# Altium schematic sheet power + display.SchDoc
size A4; SheetNumber: 2; SheetTotal: 2
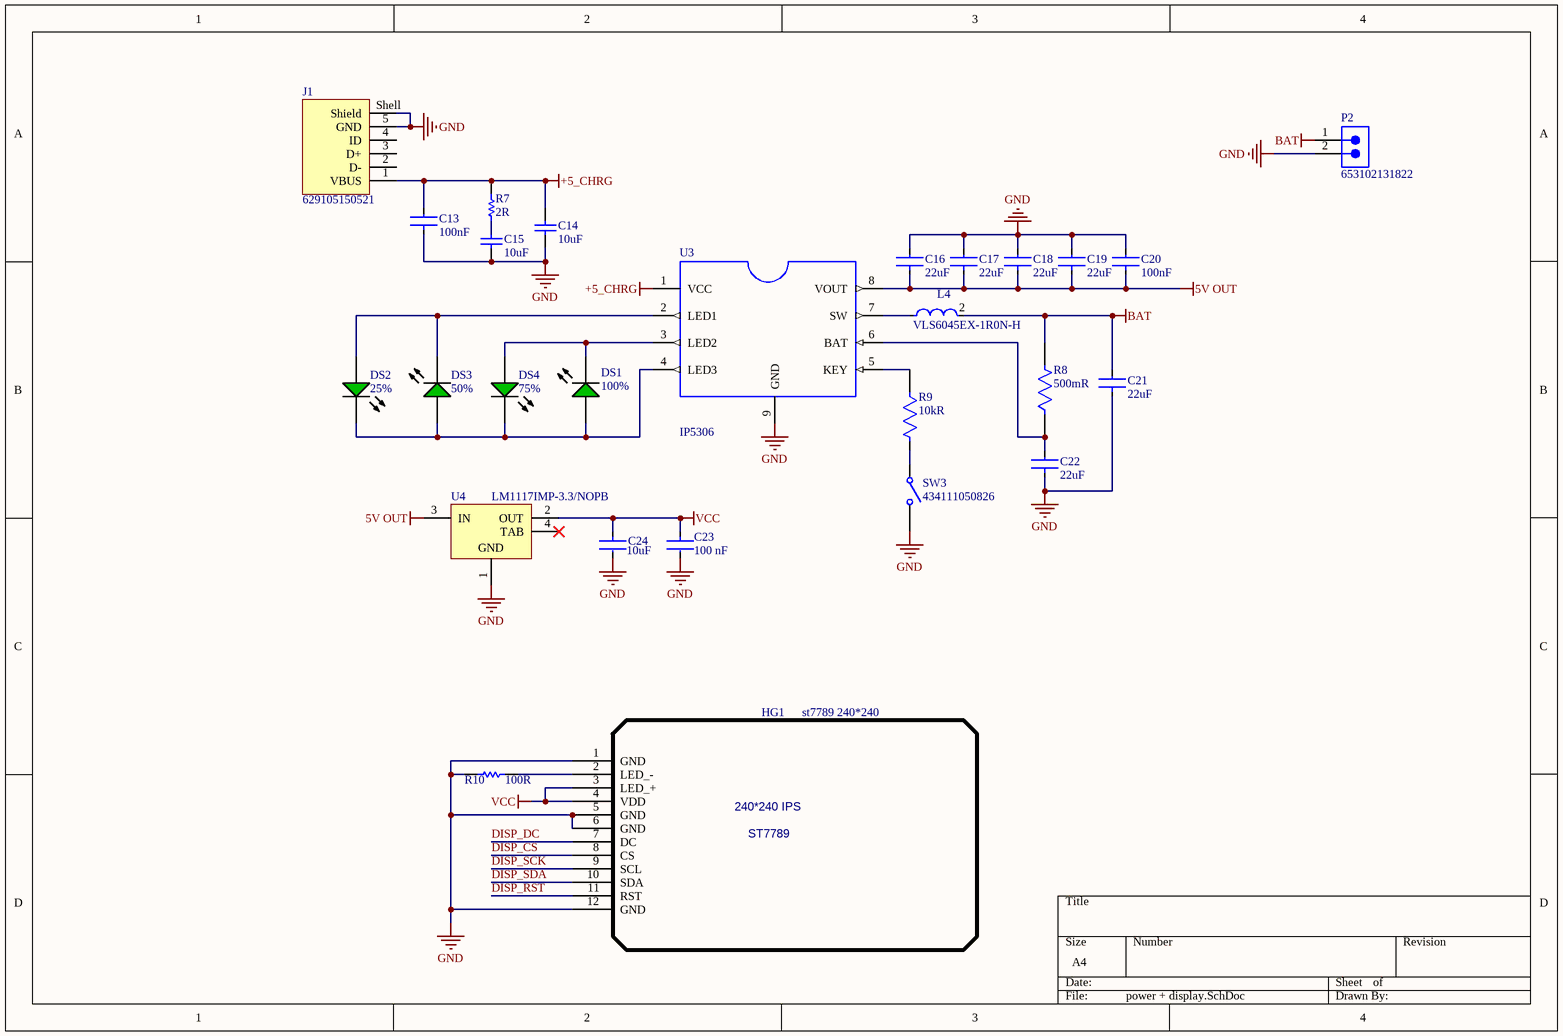
[diagram p0: power + display.SchDoc]

## Parts
C13  Capacitance: 100nF  [FP-CGA3E-0_3-0_1-IPC_A]  (hidden comment: CGA3E2X7R1H104K080AA)
C14  10uF  [CAPC2013X140X45NL15T25]
C15  10uF  [CAPC2013X140X45NL15T25]
C16  Capacitance: 22uF  [FP-1206-L_3_2_0_2-W_1_6_0-IPC_A]  (hidden comment: 12066C226KAT2A)
C17  Capacitance: 22uF  [FP-1206-L_3_2_0_2-W_1_6_0-IPC_A]  (hidden comment: 12066C226KAT2A)
C18  Capacitance: 22uF  [FP-1206-L_3_2_0_2-W_1_6_0-IPC_A]  (hidden comment: 12066C226KAT2A)
C19  Capacitance: 22uF  [FP-1206-L_3_2_0_2-W_1_6_0-IPC_A]  (hidden comment: 12066C226KAT2A)
C20  Capacitance: 100nF  [FP-CGA3E-0_3-0_1-IPC_A]  (hidden comment: CGA3E2X7R1H104K080AA)
C21  Capacitance: 22uF  [FP-1206-L_3_2_0_2-W_1_6_0-IPC_A]  (hidden comment: 12066C226KAT2A)
C22  Capacitance: 22uF  [FP-1206-L_3_2_0_2-W_1_6_0-IPC_A]  (hidden comment: 12066C226KAT2A)
C23  value 100 nF  [FP-CC0402-MFG]  (hidden comment: CC0402KRX7R9BB104)
C24  Capacitance: 10uF  [FP-C1608-080-0_1-MFG]  (hidden comment: C1608X5R1A106K080AC)
DS1  100%  [AVAG-HSMX-C170_V]
DS2  25%  [AVAG-HSMX-C170_V]
DS3  50%  [AVAG-HSMX-C170_V]
DS4  75%  [AVAG-HSMX-C170_V]
HG1  st7789 240*240  [PCBComponent_1]
J1  629105150521  [629105150521]
L4  VLS6045EX-1R0N-H  [FP-VLS6045EX-H-MFG]
P2  653102131822  [653102131822]
R7  2R  [RESC2013X60X30ML20T20]
R8  500mR  [FP-CSR0603-IPC_B]
R9  Resistance: 10kR  [FP-MCT0603-IPC_C]  (hidden comment: MCT06030C1002FP500)
R10  100R  [RESC1609X50X30LL10T20]
SW3  434111050826  [WS-TASV_L6W3.5H5_4341x10508x6]
U3  IP5306  [SOIC9P127_490X600X170L84X42T330X241N]
U4  LM1117IMP-3.3/NOPB  [DCY0004A_N]

## Nets
5V OUT: C16.1 C17.1 C18.1 C19.1 C20.1 U3.8(VOUT) U4.3(IN)
+5_CHRG: C13.2 C14.2 J1.1(VBUS) R7.2 U3.1(VCC)
BAT: C21.2 L4.2 P2.1 R8.2
GND: C13.1 C14.1 C15.1 C16.2 C17.2 C18.2 C19.2 C20.2 C21.1 C22.1 C23.2 C24.1 HG1.1(GND) HG1.5(GND) HG1.6(GND) HG1.12(GND) J1.5(GND) J1.Shell(Shield) P2.2 R10.1 SW3.2 U3.9(GND) U4.1(GND)
VCC: C23.1 C24.2 HG1.3(LED_+) HG1.4(VDD) U4.2(OUT)
DISP_CS: HG1.8(CS)
DISP_DC: HG1.7(DC)
DISP_RST: HG1.11(RST)
DISP_SCK: HG1.9(SCL)
DISP_SDA: HG1.10(SDA)
NetC15_2: C15.2 R7.1
NetC22_2: C22.2 R8.1 U3.6(BAT)
NetDS1_1: DS1.1(A) DS2.2(K) DS3.1(A) DS4.2(K) U3.4(LED3)
NetDS1_2: DS1.2(K) DS4.1(A) U3.3(LED2)
NetDS2_1: DS2.1(A) DS3.2(K) U3.2(LED1)
NetHG1_2: HG1.2(LED_-) R10.2
NetL4_1: L4.1 U3.7(SW)
NetR9_1: R9.1 U3.5(KEY)
NetR9_2: R9.2 SW3.1

Not connected (* = marked no-connect by the designer): J1 2(D-) 3(D+) 4(ID); U4 4(TAB)*

## Notes on the sheet
- (in symbol st7789 240*240) 240*240 IPS; ST7789

## Library data of the parts
C13 C20 = CMP-2000-07546-2: Cap Ceramic 100nF 50V X7R 10% Pad SMD 0603 +125°C Automotive T/R; Weight: 7.1E-05oz; Composition: Ceramic; Max Operating Temperature: 125°C; Termination: SMD/SMT; Dielectric: X7R; Length: 1.6mm; Package Quantity: 1; REACH SVHC: No SVHC; Lead Free: Lead Free; Case Code (Metric): 1608; Min Operating Temperature: -55°C; Packaging: Tape and Reel; Tolerance: 10%; Voltage Rating: 50V; Case Code (Imperial): 0603; Case/Package: 0603; Voltage Rating (DC): 50V; Depth: 0.8mm; Radiation Hardening: No; Ratings: AEC-Q200; Mount: Surface Mount; Voltage: 50V; Thickness: 0.035inch; Width: 0.8mm; Height: 0.8mm
C14 C15 = CMP-2007-03395-1: Part Number: GRM21BR71A106KE51L; Manufacturer: Murata
C16-C19 C21 C22 = CMP-1037-04985-3: CAP CER 22UF 6.3V X7R 1206; Tolerance: 10%; Dissipation Factor: 5%; Thickness: 0.07inch; Min Operating Temperature: -55°C; Width: 1.6mm; Case Code (Metric): 3216; Construction: Flat; Max Operating Temperature: 125°C; Case/Package: 1206; Case Code (Imperial): 1206; Lead Free: Lead Free; REACH SVHC: No SVHC; Voltage Rating (DC): 6.3V; Number of Pins: 2; Contact Plating: Tin; Dielectric: X7R; Radiation Hardening: No; Depth: 1.6mm; Series: FlEXITERM; Mount: Surface Mount; Voltage Rating: 6.3V; Package Quantity: 2500; RoHS Compliant: Yes; Length: 3.2mm; Height: 1.78mm; Voltage: 6.3V; Termination: SMD/SMT; Packaging: Tape and Reel
C23 = CMP-03422-001010-1: CAP CER 0.1UF 50V X7R 0402; Manufacturer: YAGEO; Temperature Coefficient: 30ppm/°C; Material: Ceramic; Automotive Grade: NA; Tolerance: 0.1; Footprint Url: http://www.yageo.com/exep/pages/download/literatures/UPY-C_GEN_24.pdf; Category: Cap; Capacitance: 100 nF; Package: CC0402; Voltage Rating: 50 V; ComponentLink2Description: Datasheet; Temperature Characteristic: X7R; Device Class L1: Passive Components; Device Class L2: Capacitors; Digikey Description: CAP CER 0.1UF 50V X7R 0402; Octopart: https://octopart.com/cc0402krx7r9bb104-yageo-56536067; Device Class L3: Ceramic Capacitors; Height: 0.55mm; Temperature: -55°C to +125°C; Temperature Range High: +125°C; ComponentLink2URL: http://www.yageo.com/documents/recent/UPY-GP_NP0_16V-to-50V_16.pdf; Temperature Range Low: -55°C; RoHS: TRUE; Ipc Land Pattern Name: CAPC10050X50; Lead Free: Yes; Automotive: No; Manufacturer Part Number: CC0402KRX7R9BB104
C24 = CMP-2000-04979-3: Multilayer Ceramic Capacitors 10μF ±10% 10V X5R SMD 0603; Dielectric Material: Ceramic; Construction: Flat; Height: 0.8mm; Thickness: 0.035inch; Case Code (Metric): 1608; Radiation Hardening: No; Number of Pins: 2; Voltage Rating (DC): 10V; Depth: 0.8mm; Voltage: 10V; RoHS Compliant: Yes; Voltage Rating: 10V; Package Quantity: 1; Resistor Type: Ceramic; Termination: SMD/SMT; Lead Free: Lead Free; REACH SVHC: No SVHC; Tolerance: 10%; Mount: Surface Mount; Series: C; Packaging: Tape and Reel; Width: 0.8mm; Dielectric: X5R; Weight: 7.1E-05oz; Length: 1.6mm; Max Operating Temperature: 85°C; Case Code (Imperial): 0603; Case/Package: 0603; Min Operating Temperature: -55°C
DS1-DS4 = CMP-2000-05062-1: Chip LED, Green, 2.2 V, -40 to 85 degC, 2-Pin SMD, Pb-Free, Tape and Reel; Manufacturer: Avago; No. of Pins: 2; Peak Wavelength: 570nm; SVHC: NoSVHC(16-Jun-2014); Dominant Wavelength: 572nm; Forward Current If: 20mA; Viewing Angle: 170deg; Lens Shape: Rectangular; PIV Max: 5V; External Width: 1.25mm; LED Type: Standard; External Depth: 0.8mm; Opto Mounting Orientation: Top; Luminous Intensity: 15mcd; Luminous Intensity Min: 4mcd; Forward Voltage VF Max: 2.6V; External Length / Height: 2mm; Bulb Size: 1.25mmx1.4mm; Light Area Height: 1mm; Voltage Vf Typ: 2.2V; Operating Temperature Max: 85degC; Datasheet Version: Oct-08; MSL: MSL2A-4weeks; Peak Forward Current: 20mA; Package Description: 2-Pin Surface Mount Device, Body 2 x 1.25 mm, Height 0.8 mm; Datasheet URL: https://datasheet.ciiva.com/29280/180495-da-01-en-chip-led-hsmg-c170-gelb-gruen-29280971.pdf; Storage Temperature Min: -40degC; LED Colour: Green; Wavelength Typ: 570nm; Mounting Type: SMD; Forward Current If Max: 20mA; Dominant Wavelength Typ: 572nm; LED Mounting: SMD; Operating Temperature Range: -30degCto+85degC; Operating Temperature Min: -30degC; Manufacturer URL: http://www.avagotech.com/; Packaging: CutTape; Luminous Intensity Typ: 15mcd; Package Reference: HSMX-C170; Storage Temperature Max: 85degC; Opto Case Style: SMD; Forward Voltage: 2.2V
J1 = CMP-1502-03252-3: NexarPartId: 52645113; Number of Contacts: 5; Contact Resistance: 30mΩ; Connector Type: USB; Voltage Rating: 30V; Current Rating: 3A; USB Standard: USB 2.0; Gender: Receptacle; Insulation Resistance: 1GΩ; Height: 2.86mm; REACH SVHC: Unknown; RoHS: Compliant; Features: Shielded; Termination: SMD/SMT; Number of Pins: 5; Contact Plating: Gold; Packaging: Tape and Reel; Contact Material: Gold; Mount: Horizontal, Surface Mount; Max Operating Temperature: 85°C; Lead Free: Lead Free; Min Operating Temperature: -40°C; Orientation: Horizontal; Operating Supply Voltage: 30V
L4 = CMP-08253-000044-1: FIXED IND 1UH 6A 12MOHM SMD; RoHS Compliant: Yes
P2 = CMP-1502-00771-2: NexarPartId: 18818274; Number of Contacts: 2; Insulation Resistance: 100MΩ; Connector Type: Male Pin; Contact Resistance: 20mΩ; Voltage Rating: 125V; Current Rating: 1A; Gender: Male; Insulation: Insulated; Pitch: 1.25mm; Height: 4.2mm; Termination: SMD/SMT; Contact Material: Copper; Contact Plating: Tin; RoHS: Compliant; Number of Pins: 2; Length: 7.25mm; Housing Material: Nylon; Packaging: Tape and Reel; Lead Pitch: 1.25mm; Contact Mating Length: 2.1336mm; Mount: Surface Mount; Max Operating Temperature: 85°C; Contact Gender: Male; Number of Rows: 1; REACH SVHC: Unknown; Number of Positions: 2; Color: Beige, White; Operating Supply Voltage: 125V; Min Operating Temperature: -40°C; Width: 7.25mm; Flammability Rating: UL94 V-0
R7 = CMP-2001-02290-1: Part Number: RK73H2ATTD2R00F; Manufacturer: KOA Speer
R8 = CMP-26527-003904-1: General Purpose Thick Film Chip Resistor, 0603, 0.5Ω, 5%, 300ppm/°C, 0.125W; Min Operating Temperature: -55°C; Max Operating Temperature: 155°C; Packaging: Tape and Reel; Mount: Surface Mount; RoHS Compliant: Yes; Tolerance: 5%
R9 = CMP-02407-000418-1: RES SMD 100 OHM 1% 1/8W 0603; Voltage Rating: 75V; Power Rating: 100mW; Temperature Coefficient: 50ppm/°C; Max Power Dissipation: 125mW; Case/Package: 0603; Military Standard: Not; Min Operating Temperature: -55°C; Width: 0.8mm; Package Quantity: 1; Max Operating Temperature: 125°C; Tolerance: 1%; Depth: 0.85mm; Radiation Hardening: No; Mount: Surface Mount; Composition: Thin Film; Contact Plating: Tin; Lead Free: Lead Free; Case Code (Imperial): 0603; Number of Terminations: 2; Voltage Rating (DC): 75V; Length: 1.55mm; Packaging: Tape and Reel; Height: 0.022inch; Case Code (Metric): 1608
R10 = CMP-2000-03826-1: Manufacturer: Vishay Dale; Part Number: CRCW0603100RFKTA
SW3 = CMP-1459-00003-2: NexarPartId: 23272333; Throw Configuration: SPST; Illumination Type: Illuminated, Non-Illuminated; Voltage Rating: 12V; Switch Travel: 250µm; Switch Function: Off-Mom; Mechanical Life: 30kcycles; Operating Force: 260N; Contact Current Rating: 50mA; Actuator Material: Liquid Crystal Polymer, Polymer; Contact Resistance: 100mΩ; Actuator Length: 1.5mm; Termination: SMD/SMT; Contact Material: Stainless Steel, Steel; Max Operating Temperature: 85°C; REACH SVHC: No SVHC; Length: 8mm; Packaging: Tape and Reel; Min Operating Temperature: -40°C; RoHS: Compliant; Width: 3.5mm; Mount: Surface Mount; Current Rating: 50mA; Contact Plating: Silver; Height: 5mm; Insulation Resistance: 100MΩ
U3 = IP5306: RC (Pi) EMI Filter 2nd Order Low Pass 2 Channel R = 2.2kOhms, C = 1700pF 8-UFBGA, WLCSP; MF: NXP USA Inc.; Value: *; Package: UFBGA-8 NXP Semiconductors; MP: IP5306; Price: None; SnapEDA_Link: https://www.snapeda.com/parts/IP5306/NXP%20Semiconductors/view-part/6618313/?ref=snap; Check_prices: https://www.snapeda.com/parts/IP5306/NXP%20Semiconductors/view-part/6618313/?ref=eda; Availability: Not in stock
U4 = CMP-0062-01631-4: 800mA Low-Dropout Linear Regulator, 4-pin SOT-223, Pb-Free; Manufacturer: Texas Instruments; PackageTopMarking: XYTT*N05B; PowerWise: N; High-Reliability: Y; CompType: LDO IC; Code_IPC: SOT223-4; PackageReference: DCY0004A; PinCount: 4; PackageDescription: Molded SOT-223, 6.50 x 3.56 x 1.6mm Body, 4 Lead, 2.3mm Pitch; PartNumber: LM1117IMP-3.3/NOPB; RoHS: Y; ComponentLink1Description: Datasheet URL; Code_JEDEC: TO-261-AA; ComponentLink1URL: http://www.ti.com/general/docs/lit/getliterature.tsp?genericPartNumber=LM1117-N&fileType=pdf